# Altium schematic sheet XTIDA-010086_ADC.SchDoc (part 2 of 2)
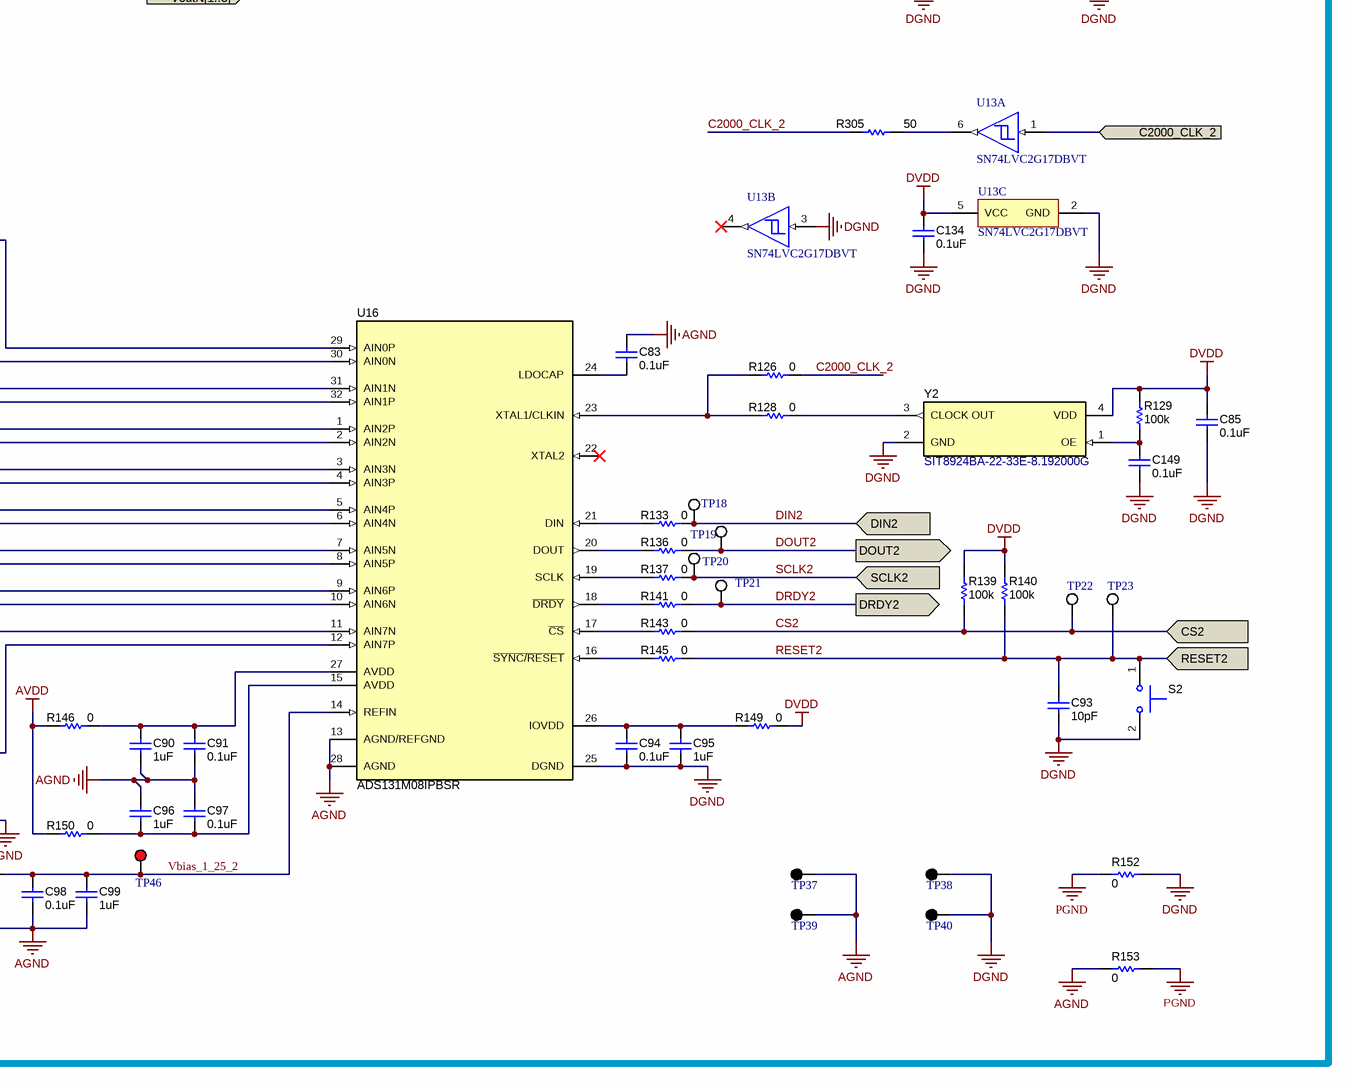
[diagram p4: XTIDA-010086_ADC.SchDoc, bottom right]

## Library data of the parts
C30 C43 C44 C55 C136 C454 C455 C460 = C0603C104J3RACTU: CAP, CERM, 0.1 µF, 25 V, +/- 5%, X7R, 0603; Manufacturer: Kemet; Polarized: N; CompType: Capacitor; Value: 0.1uF; U/M: EA; Cap_F: 0.0000001; Tolerance_%: 5; Value1: Unknown; VDC_V: 25; Value2: 25V; TaMin_C: -55; TaMax_C: 125; AEC Category: Q200; AEC Qualified: Y; SizeArea_mm2: 1.28; SizeAreaWB_mm2: 4.68; SizeX_mm: 1.6; SizeY_mm: 0.8; SizeZ_mm: 1; SymbolVersion: 2008-07-09; PartNumber: C0603C104J3RACTU; PackageReference: 0603; RoHS: Y; MountType: SMT; Technology: Ceramic; TempCo: X7R; Cap_Case: 0603; Published: 2008-06-19; Publisher: Texas Instruments; LatestRevisionDate: 2016-09-23; ComponentLink1Description: Datasheet link; ComponentLink1URL: http://www.kemet.com/kemet/web/homepage/kechome.nsf/vapubfiles/F3102_Y5V.pdf/$file/F3102_Y5V.pdf; Supplier 1: Digi-Key; Supplier Part Number 1: 399-1282-1-ND; Supplier 2: Mouser; Supplier Part Number 2: 80-C0603C104J3R; Supplier 3: Farnell; Supplier Part Number 3: 1650833
C41 C47 C449 C459 = ZRB18AD71A106KE01L: CAP, CERM, 10 µF, 10 V, +/- 10%, X7T, 0603; Manufacturer: MuRata; Polarized: N; CompType: Capacitor; Value: 10uF; U/M: EA; Cap_F: 0.00001; Tolerance_%: 10; Value1: Unknown; Value2: 10V; TaMin_C: -55; TaMax_C: 125; Cap_Case: 0603; AEC Category: Q200; SymbolVersion: 2008-07-09; PartNumber: ZRB18AD71A106KE01L; PackageReference: 0603; RoHS: Y; VDC_V: 10; MountType: SMT; Technology: Ceramic; TempCo: X7T; Published: 2008-06-19; Publisher: Texas Instruments; LatestRevisionDate: 2015-11-13; ComponentLink1Description: Datasheet link; ComponentLink1URL: http://search.murata.co.jp/Ceramy/image/img/A01X/G101/ENG/ZRB18AD71A106KE01-01.pdf; Supplier 1: Digi-Key; Supplier Part Number 1: 490-10987-1-ND; Supplier 2: Mouser; Supplier Part Number 2: 81-ZRB18AD71A106KE1L; AEC Qualified: N; AEC Grade: N/A
C42 C453 = Capacitor: CAP, CERM, 1 uF, 25 V, +/- 10%, X7R, 0603; Manufacturer: MuRata; Polarized: N; Value: 1uF; U/M: EA; Cap_F: 1µF; Value1: Unknown; TaMin_C: -55°C; TaMax_C: 125°C; AEC Category: Q200; SizeArea_mm2: 1.28; SizeAreaWB_mm2: 4.68; SizeX_mm: 1.6; SizeY_mm: 0.8; SizeZ_mm: 1; CompType: Capacitor; PartNumber: GRM188R71E105KA12D; PackageReference: 0603; RoHS: Y; Tolerance_%: 10%; Value2: 25V; MountType: SMT; Technology: Ceramic; TempCo: X7R; Cap_Case: 0603; Published: 2008-06-19; Publisher: Texas Instruments; LatestRevisionDate: 2017-03-09; ComponentLink1Description: Datasheet link; ComponentLink1URL: http://search.murata.co.jp/Ceramy/PnsearchViewAction.do?HnOFG=ON&HnNFG=ON&SEL_CNT=50&sLang=en&sKey=GRM188R71E105KA12D&x=9&y=9&search=startwith; Supplier 1: Digi-Key; Supplier Part Number 1: 490-5307-1-ND; Supplier 2: Mouser; Supplier Part Number 2: 81-GRM188R71E105KA2D; Supplier 3: Farnell; Supplier Part Number 3: 1735540; AEC Qualified: ?
C46 C461 = 06035A101JAT2A: CAP, CERM, 100 pF, 50 V, +/- 5%, C0G/NP0, 0603; Manufacturer: AVX; Polarized: N; CompType: Capacitor; Value: 100pF; U/M: EA; Cap_F: 0.0000000001; Tolerance_%: 5; ESR_ohm: 0.119; Value1: 0.119 ohm; VDC_V: 50; Value2: 50V; TaMin_C: -55; TaMax_C: 125; SizeArea_mm2: 1.28; SizeAreaWB_mm2: 4.68; SizeX_mm: 1.6; SizeY_mm: 0.8; SizeZ_mm: 1; AEC Category: Q200; SymbolVersion: 2008-07-09; PartNumber: 06035A101JAT2A; PackageReference: 0603; RoHS: Y; MountType: SMT; Technology: Ceramic; TempCo: C0G/NP0; Cap_Case: 0603; Published: 2008-06-19; Publisher: Texas Instruments; LatestRevisionDate: 2017-03-03; ComponentLink1Description: Datasheet link; ComponentLink1URL: http://datasheets.avx.com/C0GNP0-Dielectric.pdf; Supplier 1: Digi-Key; Supplier Part Number 1: 478-1175-1-ND; Supplier 2: Newark; Supplier Part Number 2: 96K4763; Supplier 3: Mouser; Supplier Part Number 3: 581-06035A101J; AEC Qualified: N; AEC Grade: N/A
C51 C60 C61 C63 C65-C68 C71 C81 C82 C84 C86-C89 C92 C130 C132 C133 C187 C190 C192 C193 = CGA2B2C0G1H100D050BA: CAP, CERM, 10 pF, 50 V,+/- 5%, C0G/NP0, AEC-Q200 Grade 1, 0402; Manufacturer: TDK; Polarized: N; CompType: Capacitor; Value: 10pF; U/M: EA; Cap_F: 0.00000000001; Tolerance_%: 5; VDC_V: 50; Value2: 50V; TaMin_C: -55; TaMax_C: 125; SizeArea_mm2: 0.5; SizeAreaWB_mm2: 3; SizeX_mm: 1; SizeZ_mm: 0.6; AEC Category: Q200; AEC Qualified: Y; SymbolVersion: 2008-07-09; PartNumber: CGA2B2C0G1H100D050BA; PackageReference: 0402; RoHS: Y; MountType: SMT; Technology: Ceramic; TempCo: C0G/NP0; Cap_Case: 0402; SizeY_mm: 0.5; Published: 2008-06-19; Publisher: Texas Instruments; LatestRevisionDate: 2017-06-22; ComponentLink1Description: Datasheet link; ComponentLink1URL: https://product.tdk.com/info/en/documents/chara_sheet/CGA2B2C0G1H100D050BA.pdf; Supplier 1: Digi-Key; Supplier Part Number 1: 445-5584-1-ND; Supplier 2: Newark; Supplier Part Number 2: 52W9563; Supplier 3: Mouser; Supplier Part Number 3: 810-CGA2B2C0G1H100D; AEC Grade: 1
C62 C64 C70 C73 C76 C77 C80 C83 C85 C91 C94 C97 C98 C101 C122 C123 C127-C129 C131 C134 C144 C145 C148 C149 C188 C189 C191 = Capacitor: CAP, CERM, 0.1 uF, 25 V, +/- 5%, X7R, 0603; Manufacturer: AVX; Polarized: N; Value: 0.1uF; U/M: EA; Cap_F: 100nF; ESR_ohm: 0.05; Value1: 0.05 ohm; VDC_V: 25V; TaMin_C: -55°C; TaMax_C: 125°C; AEC Category: Q200; SizeArea_mm2: 1.28; SizeAreaWB_mm2: 4.68; SizeX_mm: 1.6; SizeY_mm: 0.8; SizeZ_mm: 1; CompType: Capacitor; PartNumber: 06033C104JAT2A; PackageReference: 0603; RoHS: Y; Tolerance_%: 5%; Value2: 25V; MountType: SMT; Technology: Ceramic; TempCo: X7R; Cap_Case: 0603; Published: 2008-06-19; Publisher: Texas Instruments; LatestRevisionDate: 2017-03-09; ComponentLink1Description: Datasheet link; ComponentLink1URL: http://datasheets.avx.com/X7RDielectric.pdf; Supplier 1: Digi-Key; Supplier Part Number 1: 478-3713-1-ND; Supplier 2: Mouser; Supplier Part Number 2: 581-06033C104JAT2A; Supplier 3: Farnell; Supplier Part Number 3: 1740614; AEC Qualified: N; AEC Grade: N/A
C69 C74 C75 C78 C79 C90 C95 C96 C99 C100 = Capacitor: CAP, CERM, 1 uF, 25 V, +/- 10%, X7R, 0603; Manufacturer: MuRata; Polarized: N; Value: 1uF; U/M: EA; Cap_F: 1µF; Value1: Unknown; VDC_V: 25V; TaMin_C: -55°C; TaMax_C: 125°C; AEC Category: Q200; SizeArea_mm2: 1.28; SizeAreaWB_mm2: 4.68; SizeX_mm: 1.6; SizeY_mm: 0.8; SizeZ_mm: 1; CompType: Capacitor; PartNumber: GRM188R71E105KA12D; PackageReference: 0603; RoHS: Y; Tolerance_%: 10%; Value2: 25V; MountType: SMT; Technology: Ceramic; TempCo: X7R; Cap_Case: 0603; Published: 2008-06-19; Publisher: Texas Instruments; LatestRevisionDate: 2017-03-09; ComponentLink1Description: Datasheet link; ComponentLink1URL: http://search.murata.co.jp/Ceramy/PnsearchViewAction.do?HnOFG=ON&HnNFG=ON&SEL_CNT=50&sLang=en&sKey=GRM188R71E105KA12D&x=9&y=9&search=startwith; Supplier 1: Digi-Key; Supplier Part Number 1: 490-5307-1-ND; Supplier 2: Mouser; Supplier Part Number 2: 81-GRM188R71E105KA2D; Supplier 3: Farnell; Supplier Part Number 3: 1735540; AEC Qualified: ?
C72 C93 = Capacitor: CAP, CERM, 10 pF, 50 V, +/- 5%, C0G/NP0, 0603; Manufacturer: AVX; Polarized: N; Value: 10pF; U/M: EA; ESR_ohm: 4.03d; Value1: 0.403 ohm; VDC_V: 50V; TaMin_C: -55°C; TaMax_C: 125°C; AEC Category: Q200; SizeArea_mm2: 1.28; SizeAreaWB_mm2: 4.68; SizeX_mm: 1.6; SizeY_mm: 0.8; SizeZ_mm: 1; CompType: Capacitor; PartNumber: 06035A100JAT2A; PackageReference: 0603; RoHS: Y; Cap_F: 10pF; Tolerance_%: 5%; Value2: 50V; MountType: SMT; Technology: Ceramic; TempCo: C0G/NP0; Cap_Case: 0603; Published: 2008-06-19; Publisher: Texas Instruments; LatestRevisionDate: 2017-03-09; ComponentLink1Description: Datasheet link; ComponentLink1URL: http://datasheets.avx.com/C0GNP0-Dielectric.pdf; Supplier 1: Digi-Key; Supplier Part Number 1: 478-1163-1-ND; Supplier 2: Newark; Supplier Part Number 2: 17C6435; Supplier 3: Mouser; Supplier Part Number 3: 581-06035A100J; AEC Qualified: N; AEC Grade: N/A
R7 R157 = ERJ-3RQFR22V: RES, 0.22, 1%, 0.1 W, 0603; Manufacturer: Panasonic; CompType: Resistor; Value: 0.22; Value_Code: R220; Tolerance_%: 1; Power_W: 0.1; Value2: 0.1W; TempCo: 300 ppm/C; SizeArea_mm2: 1.28; SizeX_mm: 1.6; SizeY_mm: 0.8; EIA_Code: E96; U/M: EA; AEC Category: Q200; SymbolVersion: 2009-05-29; PartNumber: ERJ-3RQFR22V; PackageReference: 0603; RoHS: Y; Res_ohm: 0.22; Value1: 1%; MountType: SMT; Technology: Thick Film; SizeZ_mm: 1; Published: 2008-06-26; Publisher: Texas Instruments; LatestRevisionDate: 2017-03-04; ComponentLink1Description: Datasheet link; ComponentLink1URL: http://www.panasonic.com/industrial/components/pdf/AOA0000CE3.pdf; Supplier 1: Digi-Key; Supplier Part Number 1: P.22AJCT-ND; Supplier 2: Newark; Supplier Part Number 2: 15R1425; Supplier 3: Mouser; Supplier Part Number 3: 667-ERJ-3RQFR22V; AEC Qualified: ?
R41 R486 = RG1608P-2491-B-T5: RES, 2.49 k, 0.1%, 0.1 W, 0603; Manufacturer: Susumu Co Ltd; CompType: Resistor; Value: 2.49k; Res_ohm: 2490; Value_Code: 2k49; Tolerance_%: 0.1; Value2: 0.1W; VDC_V: 75; TempCo: 25 ppm/C; EIA_Code: E192; U/M: EA; SymbolVersion: 2009-05-29; PartNumber: RG1608P-2491-B-T5; PackageReference: 0603; RoHS: Y; Value1: 0.1%; Power_W: 0.1; MountType: SMT; Technology: Metal Film; Published: 2008-06-26; Publisher: Texas Instruments; LatestRevisionDate: 2015-06-13; ComponentLink1Description: Datasheet link; ComponentLink1URL: http://www.susumu.co.jp/english/pdf/products-j01-01.pdf; Supplier 1: Digi-Key; Supplier Part Number 1: RG16P2.49KBCT-ND; Supplier 2: Mouser; Supplier Part Number 2: 754-RG1608P-2491-BT5; Supplier 3: Farnell; Supplier Part Number 3: 1797138
R42 R98 R108 R109 R129 R139 R140 R167 R177 R181 = Resistor: RES, 100 k, 1%, 0.1 W, 0603; Manufacturer: Yageo; Power_W: 100mW; TempCo: 100 ppm/C; Value: 100k; EIA_Code: E96; SizeX_mm: 1.6; SizeY_mm: 0.8; SizeZ_mm: 1; Value2: 0.1W; SizeArea_mm2: 1.28; AEC Qualified: N; VDC_V: 75V; AEC Category: Q200; SizeAreaWB_mm2: 4.68; Supplier Part Number 2: 603-RC0603FR-07100KL; Supplier 2: Mouser; Supplier Part Number 3: 9238727; Supplier 3: Farnell; Value_Code: 100k; RoHS: Y; Value1: 1%; MountType: SMT; Supplier 1: Digi-Key; PackageReference: 0603; Tolerance_%: 1%; Res_ohm: 100k; CompType: Resistor; PartNumber: RC0603FR-07100KL; ComponentLink1Description: Datasheet link; Supplier Part Number 1: 311-100KHRCT-ND; Technology: Thick Film; ComponentLink1URL: http://www.yageo.com/pdf/Pu-RC0603_51_PbFree_L_2.pdf; AEC Grade: N/A
R78 R489 = CRCW06032R00JNEA: RES, 2.0, 5%, 0.1 W, 0603; Manufacturer: Vishay-Dale; CompType: Resistor; Value: 2.0; Res_ohm: 2; Value_Code: 2R00; Tolerance_%: 5; Power_W: 0.1; Value2: 0.1W; VDC_V: 75; TempCo: 200 ppm/C; SizeArea_mm2: 1.28; SizeX_mm: 1.6; SizeY_mm: 0.8; SizeZ_mm: 1; EIA_Code: E24; U/M: EA; AEC Category: Q200; SymbolVersion: 2009-05-29; PartNumber: CRCW06032R00JNEA; PackageReference: 0603; RoHS: Y; Value1: 5%; MountType: SMT; Technology: Thick Film; Published: 2008-06-26; Publisher: Texas Instruments; LatestRevisionDate: 2017-03-04; ComponentLink1Description: Datasheet link; ComponentLink1URL: http://www.vishay.com/docs/20035/dcrcwe3.pdf; Supplier 1: Digi-Key; Supplier Part Number 1: 541-2.0GCT-ND; Supplier 2: Mouser; Supplier Part Number 2: 71-CRCW0603J-2-E3; Supplier 3: Farnell; Supplier Part Number 3: 1889800; AEC Qualified: ?
R79 R90-R97 R99-R107 R110-R128 R130-R138 R141-R151 R159 R160 R166 R168-R172 R174 R175 R178 R184 R186 R192 R193 R204 R457 = CRCW04020000Z0ED: RES, 0, 5%, 0.063 W, 0402; Manufacturer: Vishay-Dale; CompType: Resistor; Value: 0; Value_Code: 0000; Tolerance_%: 5; Power_W: 0.063; Value2: 0.063W; VDC_V: 50; TempCo: 200 ppm/C; SizeArea_mm2: 0.5; SizeX_mm: 1; SizeZ_mm: 0.6; EIA_Code: E24; U/M: EA; AEC Category: Q200; Green_Lifecycle: Active; Green_REACh: Passed; SymbolVersion: 2009-05-29; PartNumber: CRCW04020000Z0ED; PackageReference: 0402; RoHS: Y; Res_ohm: 0; Value1: 5%; MountType: SMT; Technology: Thick Film; SizeY_mm: 0.5; Published: 2008-06-26; Publisher: Texas Instruments; LatestRevisionDate: 2017-06-12; ComponentLink1Description: Datasheet link; ComponentLink1URL: http://www.vishay.com/docs/20035/dcrcwe3.pdf; Supplier 1: Digi-Key; Supplier Part Number 1: 541-0.0JCT-ND; Supplier 2: Newark; Supplier Part Number 2: 52K6543; Supplier 3: Mouser; Supplier Part Number 3: 71-CRCW0402-0-E3; AEC Qualified: ?; Green_EU RoHS: Passed with Exemption; Green_EU RoHS-2: Passed
R152 R153 = 5108: RES, 0, 1%, 0.5 W, 1206; Manufacturer: Keystone; CompType: Resistor; Value: 0; Tolerance_%: 1; Power_W: 0.5; Value2: 0.5W; TempCo: ppm/C; SizeArea_mm2: 5.185; SizeX_mm: 3.05; SizeY_mm: 1.7; SizeZ_mm: 0.84; U/M: EA; AEC Category: Q200; AEC Qualified: N; SymbolVersion: 2009-05-29; PartNumber: 5108; PackageReference: 1206; RoHS: Y; Res_ohm: 0; Value_Code: 0; Value1: 1%; MountType: SMT; Technology: Metal Element; Published: 2008-06-26; Publisher: Texas Instruments; LatestRevisionDate: 2017-06-12; ComponentLink1Description: Datasheet link; ComponentLink1URL: http://www.keyelco.com/product.cfm/product_id/14040/checkStock/1; Supplier 1: Digi-Key; Supplier Part Number 1: 36-5108CT-ND; Supplier 2: Newark; Supplier Part Number 2: 43Y2534; Supplier 3: Mouser; Supplier Part Number 3: 534-5108; AEC Grade: N/A
R154 R488 = RG1608P-4991-B-T5: RES, 4.99 k, 0.1%, 0.1 W, 0603; Manufacturer: Susumu Co Ltd; CompType: Resistor; Value: 4.99k; Res_ohm: 4990; Value_Code: 4k99; Tolerance_%: 0.1; Value2: 0.1W; VDC_V: 75; TempCo: 25 ppm/C; EIA_Code: E192; U/M: EA; SymbolVersion: 2009-05-29; PartNumber: RG1608P-4991-B-T5; PackageReference: 0603; RoHS: Y; Value1: 0.1%; Power_W: 0.1; MountType: SMT; Technology: Metal Film; Published: 2008-06-26; Publisher: Texas Instruments; LatestRevisionDate: 2015-06-13; ComponentLink1Description: Datasheet link; ComponentLink1URL: http://www.susumu.co.jp/english/pdf/products-j01-01.pdf; Supplier 1: Digi-Key; Supplier Part Number 1: RG16P4.99KBCT-ND; Supplier 2: Mouser; Supplier Part Number 2: 754-RG1608P-4991-BT5
R155 R218 R485 R491 = RG1608P-102-B-T5: RES, 1.00 k, 0.1%, 0.1 W, 0603; Manufacturer: Susumu Co Ltd; CompType: Resistor; Value: 1.00k; Res_ohm: 1000; Value_Code: 1k00; Tolerance_%: 0.1; Value2: 0.1W; VDC_V: 75; TempCo: 25 ppm/C; EIA_Code: E192; U/M: EA; SymbolVersion: 2009-05-29; PartNumber: RG1608P-102-B-T5; PackageReference: 0603; RoHS: Y; Value1: 0.1%; Power_W: 0.1; MountType: SMT; Technology: Metal Film; Published: 2008-06-26; Publisher: Texas Instruments; LatestRevisionDate: 2015-06-13; ComponentLink1Description: Datasheet link; ComponentLink1URL: http://www.susumu.co.jp/english/pdf/products-j01-01.pdf; Supplier 1: Digi-Key; Supplier Part Number 1: RG16P1.0KBCT-ND; Supplier 2: Mouser; Supplier Part Number 2: 754-RG1608P-102-B-T5; Supplier 3: Farnell; Supplier Part Number 3: 1797076
R156 R492 = RG1608P-4990-B-T5: RES, 499, 0.1%, 0.1 W, 0603; Manufacturer: Susumu Co Ltd; CompType: Resistor; Value: 499; Value_Code: 499R; Tolerance_%: 0.1; Value2: 0.1W; VDC_V: 75; TempCo: 25 ppm/C; EIA_Code: E192; U/M: EA; SymbolVersion: 2009-05-29; PartNumber: RG1608P-4990-B-T5; PackageReference: 0603; RoHS: Y; Res_ohm: 499; Value1: 0.1%; Power_W: 0.1; MountType: SMT; Technology: Metal Film; Published: 2008-06-26; Publisher: Texas Instruments; LatestRevisionDate: 2015-06-13; ComponentLink1Description: Datasheet link; ComponentLink1URL: http://www.susumu.co.jp/english/pdf/products-j01-01.pdf; Supplier 1: Digi-Key; Supplier Part Number 1: RG16P499BCT-ND; Supplier 2: Mouser; Supplier Part Number 2: 754-RG1608P-4990-BT5; Supplier 3: Farnell; Supplier Part Number 3: 1797198
R158 R494 = RG1608P-303-B-T5: RES, 30.0 k, 0.1%, 0.1 W, 0603; Manufacturer: Susumu Co Ltd; CompType: Resistor; Value: 30.0k; Res_ohm: 30000; Value_Code: 30k0; Tolerance_%: 0.1; Value2: 0.1W; VDC_V: 75; TempCo: 25 ppm/C; U/M: EA; AEC Category: Q200; SymbolVersion: 2009-05-29; PartNumber: RG1608P-303-B-T5; PackageReference: 0603; RoHS: Y; Value1: 0.1%; Power_W: 0.1; MountType: SMT; Technology: Metal Film; Published: 2008-06-26; Publisher: Texas Instruments; LatestRevisionDate: 2015-10-21; ComponentLink1Description: Datasheet link; ComponentLink1URL: http://www.susumu.co.jp/english/pdf/products-j01-01.pdf; Supplier 1: Digi-Key; Supplier Part Number 1: RG16P30.0KBCT-ND; Supplier 2: Mouser; Supplier Part Number 2: 754-RG1608P-303-B-T5; Supplier 3: Farnell; Supplier Part Number 3: 1797154; AEC Qualified: ?
R304 R305 = FC0402E50R0BST1: RES, 50, 0.1%, 0.05 W, 0402; Manufacturer: Vishay-Dale; CompType: Resistor; Value: 50; Value_Code: 50R0; Tolerance_%: 0.1; Power_W: 0.05; Value2: 0.05W; TempCo: 25 ppm/C; SizeArea_mm2: 0.5; SizeX_mm: 1; SizeZ_mm: 0.6; U/M: EA; AEC Category: Q200; AEC Qualified: N; SymbolVersion: 2009-05-29; PartNumber: FC0402E50R0BST1; PackageReference: 0402; RoHS: Y; Res_ohm: 50; Value1: 0.1%; MountType: SMT; Technology: Thin Film; SizeY_mm: 0.5; Published: 2008-06-26; Publisher: Texas Instruments; LatestRevisionDate: 2017-06-12; ComponentLink1Description: Datasheet link; ComponentLink1URL: http://www.vishay.com/docs/60093/fcseries.pdf; Supplier 1: Digi-Key; Supplier Part Number 1: FC0402-50BWCT-ND; Supplier 2: Newark; Supplier Part Number 2: 41R5603; Supplier 3: Mouser; Supplier Part Number 3: 71-FC0402E50R0BST1; AEC Grade: N/A
S1 S2 = Switch_PushButton: Switch, Tactile, SPST-NO, 0.05A, 12V, SMT; PartNumber: TL1015AF160QG; Manufacturer: E-Switch; SwitchFunction: Off-Mom; PositionCount: 1; CurrentRating_mA: 50A; MountType: SMT; ComponentLink1Description: Datasheet URL; ComponentLink1URL: http://spec.e-switch.com/P-J/P420000.pdf; RoHS: Y; Circuit: SPST-NO; VDC_V: 12V; Orientation: Top Actuated; CompType: Switch; PackageReference: Switch, 4.4x2x2.9 mm; Publisher: Texas Instruments; LatestRevisionDate: 2017-03-09; Supplier 1: Digi-Key; Supplier Part Number 1: EG4344CT-ND; Supplier 2: Newark; Supplier Part Number 2: 15N4458; Supplier 3: Mouser; Supplier Part Number 3: 612-TL1015AF
TP12-TP23 = 5002: Test Point, Miniature, White, TH; Manufacturer: Keystone; CompType: Test Point Loop; ContactFinish: Silver; Green_Lifecycle: Active; Green_REACh: Passed; SymbolVersion: 2008-04-04; PartNumber: 5002; PackageReference: White Miniature Testpoint; RoHS: Y; MountType: TH; ComponentLink1Description: Datasheet URL; ComponentLink1URL: http://www.keyelco.com/userAssets/file/M60-2p60.pdf; Color: White; Publisher: Texas Instruments; LatestRevisionDate: 2017-05-11; Supplier 1: Digi-Key; Supplier Part Number 1: 36-5002-ND; Supplier 2: Newark; Supplier Part Number 2: 82H9632; Supplier 3: Mouser; Supplier Part Number 3: 534-5002; Green_EU RoHS: Passed; Green_EU RoHS-2: Passed
TP30 TP31 TP45 TP46 = 5000: Test Point, Miniature, Red, TH; Manufacturer: Keystone; CompType: Test Point Loop; ContactFinish: Silver; Green_Lifecycle: Active; Green_REACh: Passed; SymbolVersion: 2008-04-04; PartNumber: 5000; PackageReference: Red Miniature Testpoint; RoHS: Y; MountType: TH; ComponentLink1Description: Datasheet URL; ComponentLink1URL: http://www.keyelco.com/userAssets/file/M60-2p60.pdf; Color: Red; Publisher: Texas Instruments; LatestRevisionDate: 2017-05-11; Supplier 1: Digi-Key; Supplier Part Number 1: 36-5000-ND; Supplier 2: Mouser; Supplier Part Number 2: 534-5000; Green_EU RoHS: Passed; Green_EU RoHS-2: Incomplete
TP37-TP40 = 5001: Test Point, Miniature, Black, TH; Manufacturer: Keystone; CompType: Test Point Loop; ContactFinish: Silver; Green_Lifecycle: Active; Green_REACh: Passed; SymbolVersion: 2008-04-04; PartNumber: 5001; PackageReference: Black Miniature Testpoint; RoHS: Y; MountType: TH; ComponentLink1Description: Datasheet URL; ComponentLink1URL: http://www.keyelco.com/userAssets/file/M60-2p60.pdf; Color: Black; Publisher: Texas Instruments; LatestRevisionDate: 2017-05-11; Supplier 1: Digi-Key; Supplier Part Number 1: 36-5001-ND; Supplier 2: Mouser; Supplier Part Number 2: 534-5001; Green_EU RoHS: Passed; Green_EU RoHS-2: Incomplete
U7 U9 = ADS1119IPW: 4-Channel Single ADC Delta-Sigma 1ksps 16-bit Serial 16-Pin TSSOP T/R; Manufacturer: Texas Instruments; Interface: I2C; Number of Bits: 16; Sampling Rate: 1000S/s; Number of Inputs: 4; Number of A/D Converters: 1; PartNumber: ADS1119IPWR; RefDes: RefDes; Type: DEV; Value: Value; Copyright: Copyright (C) 2018 Accelerated Designs. All rights reserved; Supplier 1: TI store; Manufacturer Part Number: ADS1119IPWR; RoHS: No; Category: Analog to Digital Converters (ADCs); Stock 1: 2132; Pricing 1: 1=3.68000, 100=3.00000, 250=2.35800, 1000=2.00000 (USD); Case/Package: TSSOP; Min Operating Temperature: -40°C; Max Operating Temperature: 125°C; Packaging: Tape and Reel; ComponentLink1URL: http://www.ti.com/lit/ds/symlink/ads1119.pdf?src-supplier=Digi-Key; ComponentLink1Description: http://www.ti.com/lit/ds/symlink/ads1119.pdf?src-supplier=Digi-Key
U8 U13 = TI-SN74XXX2GXXX-6_A-SCHMITT: Dual Schmitt-Trigger Buffer, DBV0006A, SMALL T&R; Manufacturer: Texas Instruments; Output Type: CMOS; Logic: True; Input Type: CMOS/TTL; F @ Nom Voltage(Max)(Mhz): 150; Rating: Catalog; Sub-Family: Non-Inverting Buffer/Driver; Output Drive (IOL/IOH)(Max)(mA): 32/-32; VCC(Min)(V): 1.65; Schmitt Trigger: Yes; tpd @ Nom Voltage(Max)(ns): 9.3,5.7,5.4,4.3; Technology Family: LVC; Voltage(Nom)(V): 1.8,2.5,3.3,5; VCC(Max)(V): 5.5; ICC @ Nom Voltage(Max)(mA): 0.01; 3-State Output: No; Bits(#): 2; Generic Part Number: SN74LVC2G17; Operating Temperature Range(C): -40 to 125,-40 to 85; PackageReference: DBV0006A; DatasheetVersion: SCES381N; PartNumber: SN74LVC2G17DBVT
U12 U16 = ADS131M08: 8-Channel, 24-Bit, Simultaneously-Sampling, Delta-Sigma ADC, PBS0032A (TQFP-32); Manufacturer: Texas Instruments; SizeZ_mm: 1.2; SizeArea_mm2: 49; SizeAreaWB_mm2: 81; AEC Category: Q200; AEC Qualified: N; SizeY_mm: 7; CompType: IC; ComponentLink2URL: http://www.ti.com/product/ads131m08; PackageReference: PBS0032A; ComponentLink1Description: Datasheet Link; PartNumber: ADS131M08IPBSR; ComponentLink3Description: Online Datasheet; MountType: SMT; ComponentLink1URL: http://www.ti.com/lit/ds/symlink/ads131m08.pdf; ComponentLink2Description: Product Folder; PackageDescription: TQFP-32; ComponentLink3URL: http://www.ti.com/product/ads131m08/datasheet; SizeX_mm: 7; Alternate Manufacturer: Texas Instruments
U15 U19 = REF20XX: 8ppm/°C Drift, Low-Power, Dual-Output Vref and Vref/2 Voltage Reference 5-SOT-23-THIN -40 to 125; Manufacturer: Texas Instruments; SizeX_mm: 2.8; SizeY_mm: 2.9; CompType: IC; SizeZ_mm: 1.45; SizeArea_mm2: 8.12; SizeAreaWB_mm2: 14.82; U/M: EA; Output Current: 20mA; Operating Supply Current: 460uA; Max Output Voltage: 2.5V; Quiescent Current: 360uA; Reference Type: Series; Tolerance: 0.05%; Output Type: Fixed; PackageDescription: SOT-5; PartNumber: REF2025AIDDCR; ComponentLink1URL: https://sps06.itg.ti.com/sites/KMS/crossdivteams/altium/docs/ComponentDatasheets/REF20XX_DUAL OUTPUT .pdf; ComponentLink1Description: Datasheet Link; LatestRevisionDate: 2017-03-09; Publisher: Texas Instruments; RoHS: Y; PackageReference: DBV0005A; MountType: SMT; Alternate Manufacturer: Texas Instruments; Supplier 1: Digi-Key; Manufacturer Part Number: REF2025AIDDCR; Category: Voltage References; Stock 1: 4649; Pricing 1: 1=3.26000, 10=2.93200, 25=2.77200, 100=2.27920, 250=2.04512, 500=1.97120, 1000=1.63856 (USD); Mount: Surface Mount; Case/Package: SOT-23-5; Number of Pins: 5; Min Operating Temperature: -40°C; Max Operating Temperature: 125°C; Temperature Coefficient: 8ppm/°C; Packaging: Tape and Reel; Min Output Voltage: 2.5V; Lead Free: Lead Free; ComponentLink2URL: http://components.arrow.com/part/dataview/67265776S909225N7713?src-supplier=Arrow+Electronics; ComponentLink2Description: http://components.arrow.com/part/dataview/67265776S909225N7713?src-supplier=Arrow+Electronics; ComponentLink3URL: http://www.ti.com/lit/ds/symlink/ref2025.pdf?src-supplier=Digi-Key; ComponentLink3Description: http://www.ti.com/lit/ds/symlink/ref2025.pdf?src-supplier=Digi-Key; ComponentLink4URL: http://www.ti.com/general/docs/lit/getliterature.tsp?genericPartNumber=REF2041&&fileType=pdf&src-supplier=Avnet; ComponentLink4Description: http://www.ti.com/general/docs/lit/getliterature.tsp?genericPartNumber=REF2041&&fileType=pdf&src-supplier=Avnet
U32 U414 = OPA378AIDBVT: Low-Noise, 900 kHz, RRIO, Precision Operational Amplifier, Zerø-Drift Series, 2.2 to 5.5 V, -40 to 125 degC, 5-pin SOT23 (DBV0005A), Green (RoHS & no Sb/Br); Manufacturer: Texas Instruments; Alternate PartNumber: Equivalent; CMRR(Min)(dB): 100; IIB(Max)(pA): 550; Iq per channel(Max)(mA): 0.15; Number of Channels: 1; Offset Drift(Typ)(uV/C): 0.1; Slew Rate(Typ)(V/us): 0.4; Sub Family: Low Input Bias Current Amp (<=10pA), Low Offset Voltage Amplifier (<=500uV), Low Power Amp (<=500uA), Low Supply Voltage Amplifier (<=2.7V), Precision Amplifier, Zero Drift Precision Amplifier; Total Supply Voltage(Max)(+5V is 5, +/-5V is 10): 5.5; Total Supply Voltage(Min)(+5V is 5, +/-5V is 10): 2.2; Vio (25C)(Max)(mV): 0.05; Vn at 1kHz(Typ)(nV/rtHz): 20; DatasheetVersion: SBOS417D; PackageVersion: 4073253-4/K, 03/2006; PackageReference: DBV0005A; PackageDescription: 5-Pin Plastic Small Outline, Body 1.6 x 2.9 mm, Pitch 0.95 mm; Supplier 1: Digi-Key; Supplier Part Number 1: 296-24619-2-ND; Supplier 2: Digi-Key; Supplier Part Number 2: 296-24619-1-ND; Supplier 3: Digi-Key; Supplier Part Number 3: 296-24619-6-ND; Supplier 4: Farnell; Supplier Part Number 4: 1735565; Supplier 5: Newark; Supplier Part Number 5: 14R7884; Supplier 6: Mouser; Supplier Part Number 6: 595-OPA378AIDBVT; Eco-Plan: Green (RoHS & no Sb/Br); MountType: SMT; Code_JEDEC: MO-178; PartNumber: OPA378AIDBVT; ComponentLink1Description: Manufacturer URL; ComponentLink1URL: http://www.ti.com/; ComponentLink2Description: Datasheet; ComponentLink2URL: http://www.ti.com/general/docs/lit/getliterature.tsp?genericPartNumber=OPA378&fileType=pdf; ComponentLink3Description: Package Specification; ComponentLink3URL: http://www.ti.com/litv/pdf/mpds018i; Alternate Manufacturer: Texas Instruments
U33 U41 = OPA837IDBVR: LOW POWER HIGH SPEED OP AMP; SourceLibrary: TI_2019-05-11; Built_By: EMA_Molly; Vendor: Texas Instruments; Slew Rate: 105V/µs; Number of Circuits: 1; Gain Bandwidth Product: 50MHz; Input Bias Current: 340nA; Input Offset Voltage (Vos): 30uV; Operating Supply Current: 592uA; Copyright: Copyright (C) 2018 Accelerated Designs. All rights reserved; Manufacturer_Part_Number: OPA837IDBVR; RefDes: RefDes; Type: DEV; Supplier 1: Digi-Key; Manufacturer: Texas Instruments; Manufacturer Part Number: OPA837IDBVR; RoHS: No; Category: Amplifiers - Op Amps, Buffer, Instrumentation; Stock 1: 491; Pricing 1: 1=2.28000, 10=2.05100, 25=1.93520, 100=1.54800, 250=1.35452, 500=1.31580, 1000=1.04490 (USD); Mount: Surface Mount; Case/Package: SOT-23-6; Min Operating Temperature: -40°C; Max Operating Temperature: 125°C; Packaging: Tape and Reel; Number of Channels: 1; ComponentLink1URL: http://www.ti.com/lit/ds/symlink/opa837.pdf?src-supplier=Digi-Key; ComponentLink1Description: http://www.ti.com/lit/ds/symlink/opa837.pdf?src-supplier=Digi-Key; Supplier Part Number 1: 296-49253-1-ND; PartNumber: OPA837IDBVR
Y1 Y2 = OSC_4P_1_OE: Oscillator, 8.192 MHz, 15 pF, AEC-Q200 Grade 1, SMD; Manufacturer: SiTime; TaMin_C: -40°C; Frequency Stability: 25 ppm; SizeAreaWB_mm2: 14.7; Load Capacitance: 15 pF; TaMax_C: 125°C; SizeZ_mm: 0.8; SizeX_mm: 2.5; SizeY_mm: 3.2; SizeArea_mm2: 8; AEC Qualified: Y; AEC Grade: 1; AEC Category: Q200; ComponentLink1URL: https://www.sitime.com/datasheet/SiT8924; Supplier Part Number 2: 788-8924BA223E8.192G; Supplier 2: Mouser; RoHS: Y; MountType: SMT; Frequency_Fixed: 8.192MHz; Supplier 1: Digi-Key; PackageReference: 3.2x2.5mm; CompType: Oscillator; PartNumber: SIT8924BA-22-33E-8.192000G; ComponentLink1Description: Datasheet Link; Supplier Part Number 1: 1473-1658-1-ND